# EAGLE design double-glide (EAGLE 7.7.0)
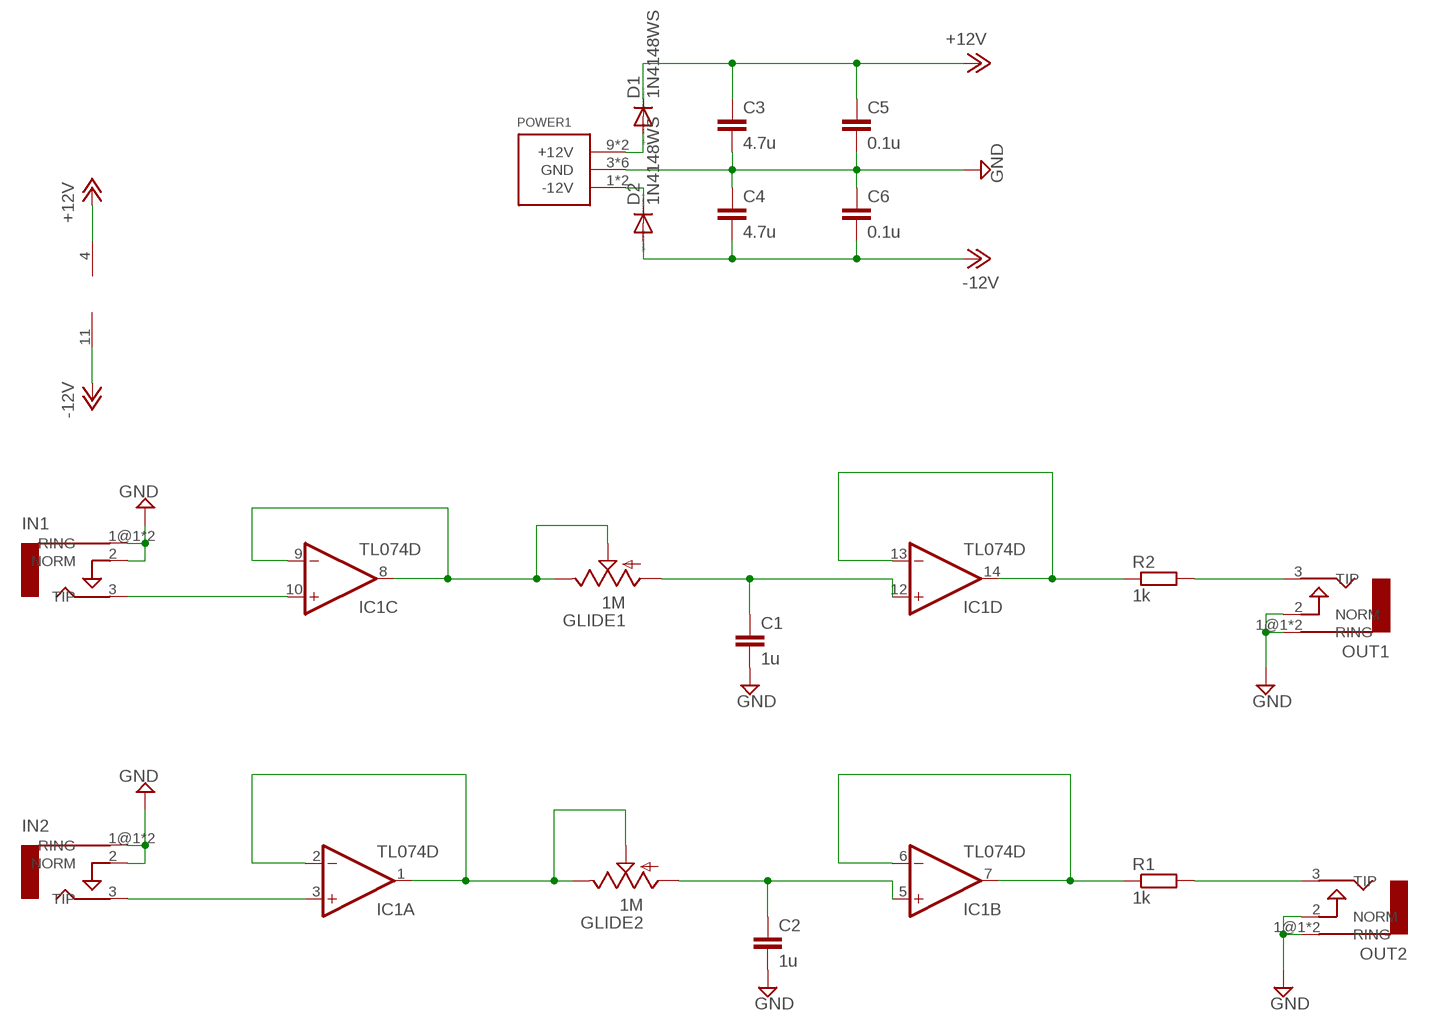
[diagram p0: schematic, sheet 1]

## Parts
C1  1u  C-EUC0805  [C0805]
C2  1u  C-EUC0805  [C0805]
C3  4.7u  C-EUC0805  [C0805]
C4  4.7u  C-EUC0805  [C0805]
C5  0.1u  C-EUC0805  [C0805]
C6  0.1u  C-EUC0805  [C0805]
D1  1N4148WS  DIODE-SOD323-W  [SOD323-W]
D2  1N4148WS  DIODE-SOD323-W  [SOD323-W]
GLIDE1  1M  9MM_SNAP-IN_POT_  [9MM_SNAP-IN_POT]
GLIDE2  1M  9MM_SNAP-IN_POT_  [9MM_SNAP-IN_POT]
IC1  TL074D  [SO14]
IN1  AUDIO-JACKERTHENVAR  [ERTHENVAR-JACK]
IN2  AUDIO-JACKERTHENVAR  [ERTHENVAR-JACK]
OUT1  AUDIO-JACKERTHENVAR  [ERTHENVAR-JACK]
OUT2  AUDIO-JACKERTHENVAR  [ERTHENVAR-JACK]
POWER1  POWER_SIMPLE10  [POWER_10]
R1  1k  R-EU_R0805  [R0805]
R2  1k  R-EU_R0805  [R0805]

## Nets
+12V: C3.1 C5.1 D1.C IC1.4(P:V+)
-12V: C4.2 C6.2 D2.A IC1.11(P:V-)
GND: C1.2 C2.2 C3.2 C4.1 C5.2 C6.1 IN1.1@1(RING) IN1.1@2(RING) IN1.2(NORM) IN2.1@1(RING) IN2.1@2(RING) IN2.2(NORM) OUT1.1@1(RING) OUT1.1@2(RING) OUT1.2(NORM) OUT2.1@1(RING) OUT2.1@2(RING) OUT2.2(NORM) POWER1.3(GND) POWER1.4(GND) POWER1.5(GND) POWER1.6(GND) POWER1.7(GND) POWER1.8(GND)
N$1: GLIDE1.2(S) GLIDE1.3(E) IC1.8(C:OUT) IC1.9(C:-IN)
N$2: IC1.13(D:-IN) IC1.14(D:OUT) R2.1
N$3: GLIDE2.2(S) GLIDE2.3(E) IC1.1(A:OUT) IC1.2(A:-IN)
N$4: IC1.6(B:-IN) IC1.7(B:OUT) R1.1
N$5: IC1.3(A:+IN) IN2.3(TIP)
N$6: IC1.10(C:+IN) IN1.3(TIP)
N$7: C1.1 GLIDE1.1(A) IC1.12(D:+IN)
N$8: C2.1 GLIDE2.1(A) IC1.5(B:+IN)
N$9: OUT2.3(TIP) R1.2
N$10: D1.A POWER1.9(+12V) POWER1.10(+12V)
N$11: OUT1.3(TIP) R2.2
N$18: D2.C POWER1.1(-12V) POWER1.2(-12V)

## Library data of the parts
C1-C6 = rcl:C-EU: CAPACITOR, European symbol
D1 D2 = diode:DIODE-: DIODE
GLIDE1 GLIDE2 = MusicThingModular:9MM_SNAP-IN_POT: 9mm vertical snap-in pot, Alpha / Panasonic style
IC1 = linear:TL074: OP AMP
IN1 IN2 OUT1 OUT2 = erthenvar:AUDIO-JACK: Switching Mono 3.5mm Audio Jack from Erthenvar.
POWER1 = eurorack:POWER_SIMPLE
R1 R2 = rcl:R-EU_: RESISTOR, European symbol

## Board
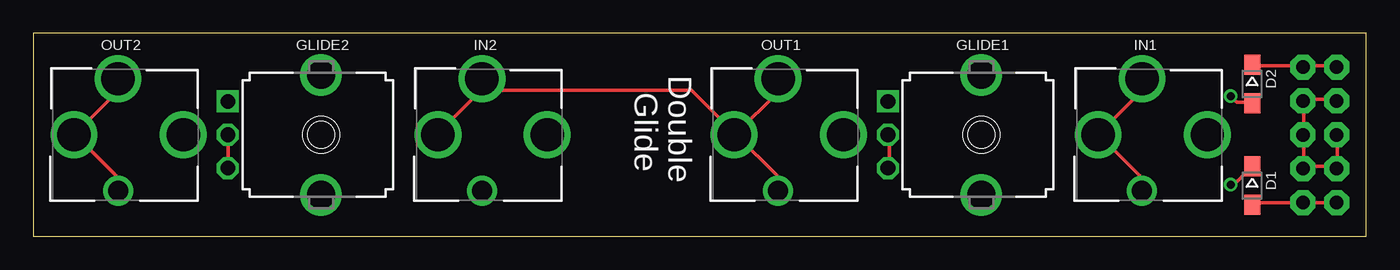
[diagram p1: board, top side]
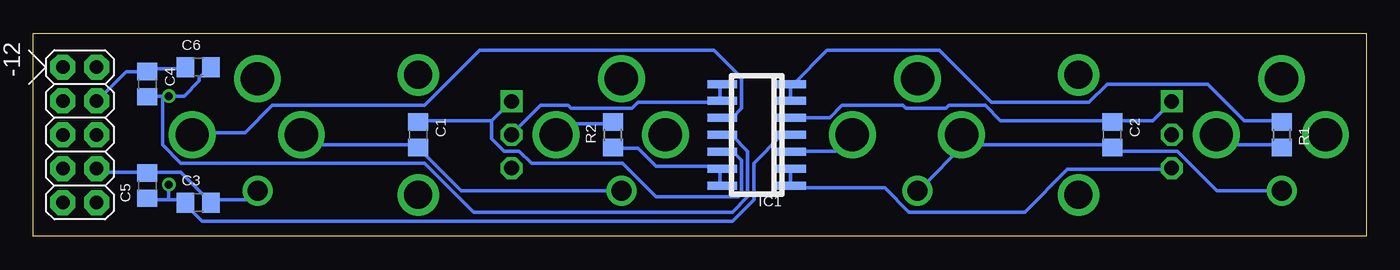
[diagram p2: board, bottom side, seen from below]

Size 100 x 15.23 mm. Coordinates in mm from the lower left corner, seen from the top.
Outline: 0,0 100,0 100,15.23 0,15.23 0,0
Copper layers (1*16): Top 0.035mm / dielectric 1.5mm / Bottom 0.035mm
Design rules "default": minimum track width 10mil, minimum drill 24mil, track to track 8mil, track to pad 8mil, pad to pad 8mil, via to via 8mil, smd to smd 8mil, copper to edge 40mil, drill to drill 8mil, minimum pad ring 10mil, minimum via ring 8mil, stop-mask expansion 4mil, vias tented up to drill 0mil, thermal gap 10mil

### Footprints (pad centres in the part's own frame; a part is rotated, then mirrored left to right if it is on the bottom)
C0805 = smd 1.3 x 1.5: 1 -0.95,0; 2 0.95,0
SOD323-W = smd 1.5 x 1.2: A 1.45,0; C -1.45,0
9MM_SNAP-IN_POT = drill 1.1 square: 1 -2.5,-7 | drill 1.1 octagon: 2 0,-7; 3 2.5,-7 | drill 2.1 pad 2.794: CHASSIS1 -4.5,0; CHASSIS2 4.5,0
SO14 = smd 0.6 x 2.2: 1 -3.81,-2.6; 2 -2.54,-2.6; 3 -1.27,-2.6; 4 0,-2.6; 5 1.27,-2.6; 6 2.54,-2.6; 7 3.81,-2.6; 8 3.81,2.6; 9 2.54,2.6; 10 1.27,2.6; 11 0,2.6; 12 -1.27,2.6; 13 -2.54,2.6; 14 -3.81,2.6
ERTHENVAR-JACK = drill 2.5: 1@1 -4.2,0; 2 0,-3.3; 3 0,4.9 | drill 1.5: 1@2 4.2,0
POWER_10 = drill 1.016 pad 1.88 octagon: 1 -5.08,-1.27; 2 -5.08,1.27; 3 -2.54,-1.27; 4 -2.54,1.27; 5 0,-1.27; 6 0,1.27; 7 2.54,-1.27; 8 2.54,1.27; 9 5.08,-1.27; 10 5.08,1.27
R0805 = smd 1.3 x 1.5: 1 -0.95,0; 2 0.95,0

### Placement (x,y rotation side)
C1  71.12,7.62 270 bottom
C2  19.05,7.62 270 bottom
C3  87.63,2.54 0 bottom
C4  91.44,11.43 270 bottom
C5  91.44,3.81 90 bottom
C6  87.63,12.7 0 bottom
D1  91.44,3.81 270 top
D2  91.44,11.43 270 top
GLIDE1  71.12,7.62 270 top
GLIDE2  21.59,7.62 270 top
IC1  45.72,7.62 90 bottom
IN1  83.19,7.62 270 top
IN2  33.66,7.62 270 top
OUT1  55.88,7.62 270 top
OUT2  6.35,7.62 270 top
POWER1  96.52,7.62 270 bottom
R1  6.35,7.62 270 bottom
R2  56.52,7.62 90 bottom

### Tracks (layer width: path | path; a pad name or v marks a point on that pad's centre or on a via)
+12V  (via drill 0.61)
  Top 0.254: v89.84,3.89 90.07,3.89 D1.C
  Bottom 0.254: 89.84,2.74 91.44,2.74 C5.1 | 89.84,2.74 88.7,2.74 C3.1 88.7,2.52 87.33,1.14 47.55,1.14 45.95,2.74 45.95,5.49 43.89,7.54 43.2,7.54 IC1.4 | 89.84,2.74 v89.84,3.89
-12V  (via drill 0.61)
  Top 0.254: v89.84,10.52 90.3,10.06 91.44,10.06 D2.A
  Bottom 0.254: 90.3,10.52 91.44,10.52 C4.2 | C6.2 86.87,12.57 87.55,11.89 87.55,11.66 88.7,10.52 v89.84,10.52 90.3,10.52 | 90.3,10.52 90.3,6.86 88.92,5.49 70.64,5.49 66.98,1.83 47.55,1.83 46.41,2.97 46.41,6.4 47.55,7.54 48.23,7.54 IC1.11
GND
  Top 0.254: OUT2.1@2 6.17,3.43 6.17,4.57 3.2,7.54 OUT2.2 3.2,7.77 6.17,10.74 6.17,11.66 OUT2.1@1 | 33.6,10.97 33.6,11.66 IN2.1@1 33.6,10.97 | 33.6,10.97 30.4,7.77 IN2.2 | OUT1.1@2 55.78,3.43 55.78,4.57 52.81,7.54 OUT1.2 | OUT1.1@1 55.78,11.66 55.78,10.74 52.81,7.77 OUT1.2 | POWER1.5 97.84,7.54 97.84,5.26 POWER1.7 97.61,5.26 95.33,5.26 | POWER1.3 97.61,10.29 95.33,10.29 POWER1.4 95.33,10.06 95.33,7.77 POWER1.6 95.33,7.54 95.33,5.26 | 95.33,5.26 POWER1.8 | IN1.1@2 82.98,3.43 82.98,4.57 80.01,7.54 IN1.2 80.01,7.77 82.98,10.74 82.98,11.66 IN1.1@1 | 33.6,10.97 49.38,10.97 52.58,7.77 OUT1.2
  Bottom 0.254: 29.72,7.09 30.18,7.54 IN2.2 29.72,7.09 | 29.72,7.09 29.49,6.86 19.2,6.86 C2.2 18.97,6.63 18.75,6.4 14.17,6.4 11.2,3.43 6.4,3.43 OUT2.1@2 | 29.72,7.09 29.95,7.09 33.6,3.43 IN2.1@2 | 91.44,4.8 94.87,4.8 95.1,5.03 POWER1.8 | C6.1 88.7,12.57 91.44,12.57 C4.1 91.44,12.34 93.04,12.34 95.1,10.29 POWER1.4 | IN1.1@2 83.21,3.2 83.67,2.74 86.64,2.74 C3.2 86.87,2.74 88.92,4.8 91.44,4.8 | IN1.2 79.78,7.54 79.1,6.86 71.32,6.86 C1.2 71.09,6.63 67.89,3.43 56.01,3.43 OUT1.1@2 | 91.44,4.8 C5.2
N$1
  Top 0.254: GLIDE1.3 64.24,5.26 64.24,7.54 GLIDE1.2
  Bottom 0.254: IC1.8 48.46,11.43 48.46,10.29 IC1.9 48.46,10.06 54.63,10.06 55.09,9.6 59.66,9.6 59.89,9.83 61.95,9.83 64.01,7.77 GLIDE1.2
N$2
  Bottom 0.254: R2.1 56.46,6.63 54.63,6.63 53.26,5.26 48.46,5.26 IC1.13 48.46,5.03 48.46,3.89 IC1.14
N$3
  Top 0.254: GLIDE2.2 14.63,7.54 14.63,5.26 GLIDE2.3
  Bottom 0.254: IC1.2 43.2,5.03 43.2,3.89 IC1.1 42.98,3.66 36.12,3.66 34.29,1.83 25.6,1.83 22.4,5.03 14.63,5.03 GLIDE2.3
N$4
  Bottom 0.254: R1.1 6.4,8.69 9.14,8.69 11.89,11.43 19.43,11.43 20.8,10.06 28.12,10.06 32,13.95 40.46,13.95 42.98,11.43 IC1.7 43.2,11.43 43.2,10.29 IC1.6
N$5
  Bottom 0.254: IC1.3 42.98,6.4 39.78,6.4 38.63,7.54 IN2.3
N$6
  Bottom 0.254: IC1.10 48.23,8.91 47.55,8.91 46.86,9.6 46.86,11.89 48.92,13.95 66.52,13.95 70.64,9.83 82.07,9.83 84.12,7.77 88.01,7.77 IN1.3
N$7
  Bottom 0.254: 65.61,8.69 71.09,8.69 C1.1 | 65.61,8.69 64.24,10.06 GLIDE1.1 | 65.61,8.69 65.61,7.32 64.69,6.4 63.55,6.4 62.64,5.49 55.78,5.49 53.26,2.97 47.09,2.97 46.86,3.2 46.86,5.71 47.32,6.17 48.23,6.17 IC1.12
N$8
  Bottom 0.254: GLIDE2.1 14.63,10.06 16,8.69 18.97,8.69 C2.1 19.2,8.69 27.43,8.69 28.57,9.83 31.32,9.83 31.55,9.6 34.52,9.6 34.75,9.83 39.32,9.83 40.23,8.91 42.98,8.91 IC1.5
N$9
  Bottom 0.254: R1.2 6.4,6.86 10.52,6.86 11.2,7.54 OUT2.3
N$10
  Top 0.254: D1.A 91.44,2.52 95.1,2.52 POWER1.10 95.33,2.52 97.61,2.52 POWER1.9
N$11
  Bottom 0.254: R2.2 56.69,8.46 59.89,8.46 60.58,7.77 OUT1.3
N$18
  Top 0.254: D2.C 91.44,12.8 95.1,12.8 POWER1.2 95.33,12.8 97.61,12.8 POWER1.1

### Text on the board
tNames: Double | Glide